# Altium schematic sheet 主控板.SchDoc
size A4
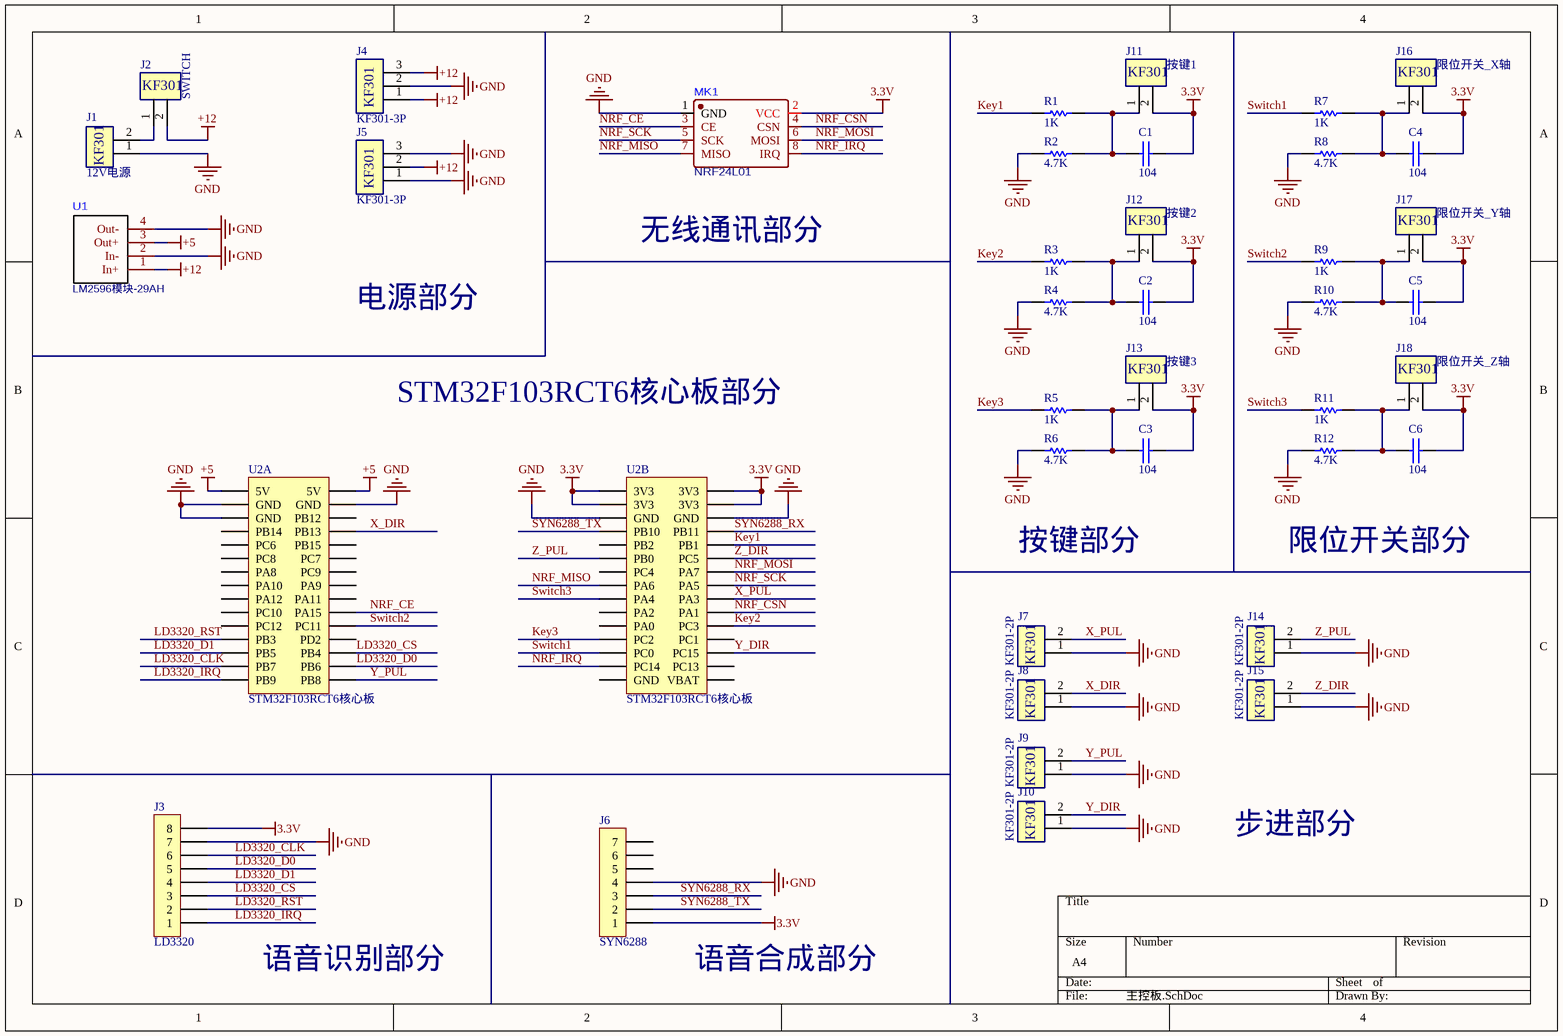
[diagram p0: 主控板.SchDoc]

## Parts
C1  104  [0805C]
C2  104  [0805C]
C3  104  [0805C]
C4  104  [0805C]
C5  104  [0805C]
C6  104  [0805C]
J1  12V电源  [KF301-5.0-2P]
J2  SWITCH  [KF301-5.0-2P]
J3  LD3320  [Fe-HDR1X8/2.54-S]
J4  KF301-3P  [KF301-5.0-3P]
J5  KF301-3P  [KF301-5.0-3P]
J6  SYN6288  [Fe-HDR1X7/2.54-S]
J7  KF301-2P  [KF301-5.0-2P]
J8  KF301-2P  [KF301-5.0-2P]
J9  KF301-2P  [KF301-5.0-2P]
J10  KF301-2P  [KF301-5.0-2P]
J11  按键1  [KF301-5.0-2P]
J12  按键2  [KF301-5.0-2P]
J13  按键3  [KF301-5.0-2P]
J14  KF301-2P  [KF301-5.0-2P]
J15  KF301-2P  [KF301-5.0-2P]
J16  限位开关_X轴  [KF301-5.0-2P]
J17  限位开关_Y轴  [KF301-5.0-2P]
J18  限位开关_Z轴  [KF301-5.0-2P]
MK1  NRF24L01  [WIRELM-SMD_NRF24L01]
R1  1K  [0805R]
R2  4.7K  [0805R]
R3  1K  [0805R]
R4  4.7K  [0805R]
R5  1K  [0805R]
R6  4.7K  [0805R]
R7  1K  [0805R]
R8  4.7K  [0805R]
R9  1K  [0805R]
R10  4.7K  [0805R]
R11  1K  [0805R]
R12  4.7K  [0805R]
U1  LM2596模块-29AH  [LM2596]
U2  STM32F103RCT6核心板  [STM32F103RC]  (parts A,B of 2)

## Nets
3.3V: C1.2 C2.2 C3.2 C4.2 C5.2 C6.2 J3.8 J6.1 J11.2 J12.2 J13.2 J16.2 J17.2 J18.2 MK1.2(VCC) U2.31(3V3) U2.32(3V3) U2.33(3V3) U2.34(3V3)
+5: U1.3(Out+) U2.1(5V) U2.2(5V)
+12: J2.2 J4.1 J4.3 J5.2 U1.1(In+)
GND: J1.1 J3.7 J4.2 J5.1 J5.3 J6.4 J7.1 J8.1 J9.1 J10.1 J14.1 J15.1 MK1.1(GND) R2.1 R4.1 R6.1 R8.1 R10.1 R12.1 U1.2(In-) U1.4(Out-) U2.3(GND) U2.4(GND) U2.5(GND) U2.35(GND) U2.36(GND)
Key1: R1.1 U2.40(PB1)
Key2: R3.1 U2.52(PC3)
Key3: R5.1 U2.53(PC2)
LD3320_CLK: J3.6 U2.27(PB7)
LD3320_CS: J3.3 U2.26(PB4)
LD3320_D0: J3.5 U2.28(PB6)
LD3320_D1: J3.4 U2.25(PB5)
LD3320_IRQ: J3.1 U2.29(PB9)
LD3320_RST: J3.2 U2.23(PB3)
NRF_CE: MK1.3(CE) U2.20(PA15)
NRF_CSN: MK1.4(CSN) U2.50(PA1)
NRF_IRQ: MK1.8(IRQ) U2.57(PC14)
NRF_MISO: MK1.7(MISO) U2.45(PA6)
NRF_MOSI: MK1.6(MOSI) U2.44(PA7)
NRF_SCK: MK1.5(SCK) U2.46(PA5)
Switch1: R7.1 U2.55(PC0)
Switch2: R9.1 U2.22(PC11)
Switch3: R11.1 U2.47(PA4)
SYN6288_RX: J6.3 U2.38(PB11)
SYN6288_TX: J6.2 U2.37(PB10)
X_DIR: J8.2 U2.8(PB13)
X_PUL: J7.2 U2.48(PA3)
Y_DIR: J10.2 U2.56(PC15)
Y_PUL: J9.2 U2.30(PB8)
Z_DIR: J15.2 U2.42(PC5)
Z_PUL: J14.2 U2.41(PB0)
NetC1_1: C1.1 J11.1 R1.2 R2.2
NetC2_1: C2.1 J12.1 R3.2 R4.2
NetC3_1: C3.1 J13.1 R5.2 R6.2
NetC4_1: C4.1 J16.1 R7.2 R8.2
NetC5_1: C5.1 J17.1 R9.2 R10.2
NetC6_1: C6.1 J18.1 R11.2 R12.2
NetJ1_2: J1.2 J2.1

Not connected (* = marked no-connect by the designer): J6 5 6 7; U2 6(PB12) 7(PB14) 9(PC6) 10(PB15) 11(PC8) 12(PC7) 13(PA8) 14(PC9) 15(PA10) 16(PA9) 17(PA12) 18(PA11) 19(PC10) 21(PC12) 24(PD2) 39(PB2) 43(PC4) 49(PA2) 51(PA0) 54(PC1) 58(PC13) 59(GND) 60(VBAT)

## Notes on the sheet
- 无线通讯部分
- 电源部分
- STM32F103RCT6核心板部分
- 按键部分
- 限位开关部分
- 步进部分
- 语音识别部分
- 语音合成部分
- (in symbol KF301-2P) KF301
- (in symbol KF301-3P) KF301

## Library data of the parts
C1-C6 = CAP: 无极性电容
J1 J2 J11-J13 J16-J18 = KF301-2P
J3 = Female HDR1X8
J6 = Female HDR1X7
R1-R12 = RES